# Altium schematic sheet STM32_BareBones.SchDoc: STM32_BareBones
size A4; DrawnBy: Seif Farag; DocumentNumber: P1; Revision: 1.1.1; SheetNumber: 1; SheetTotal: 1
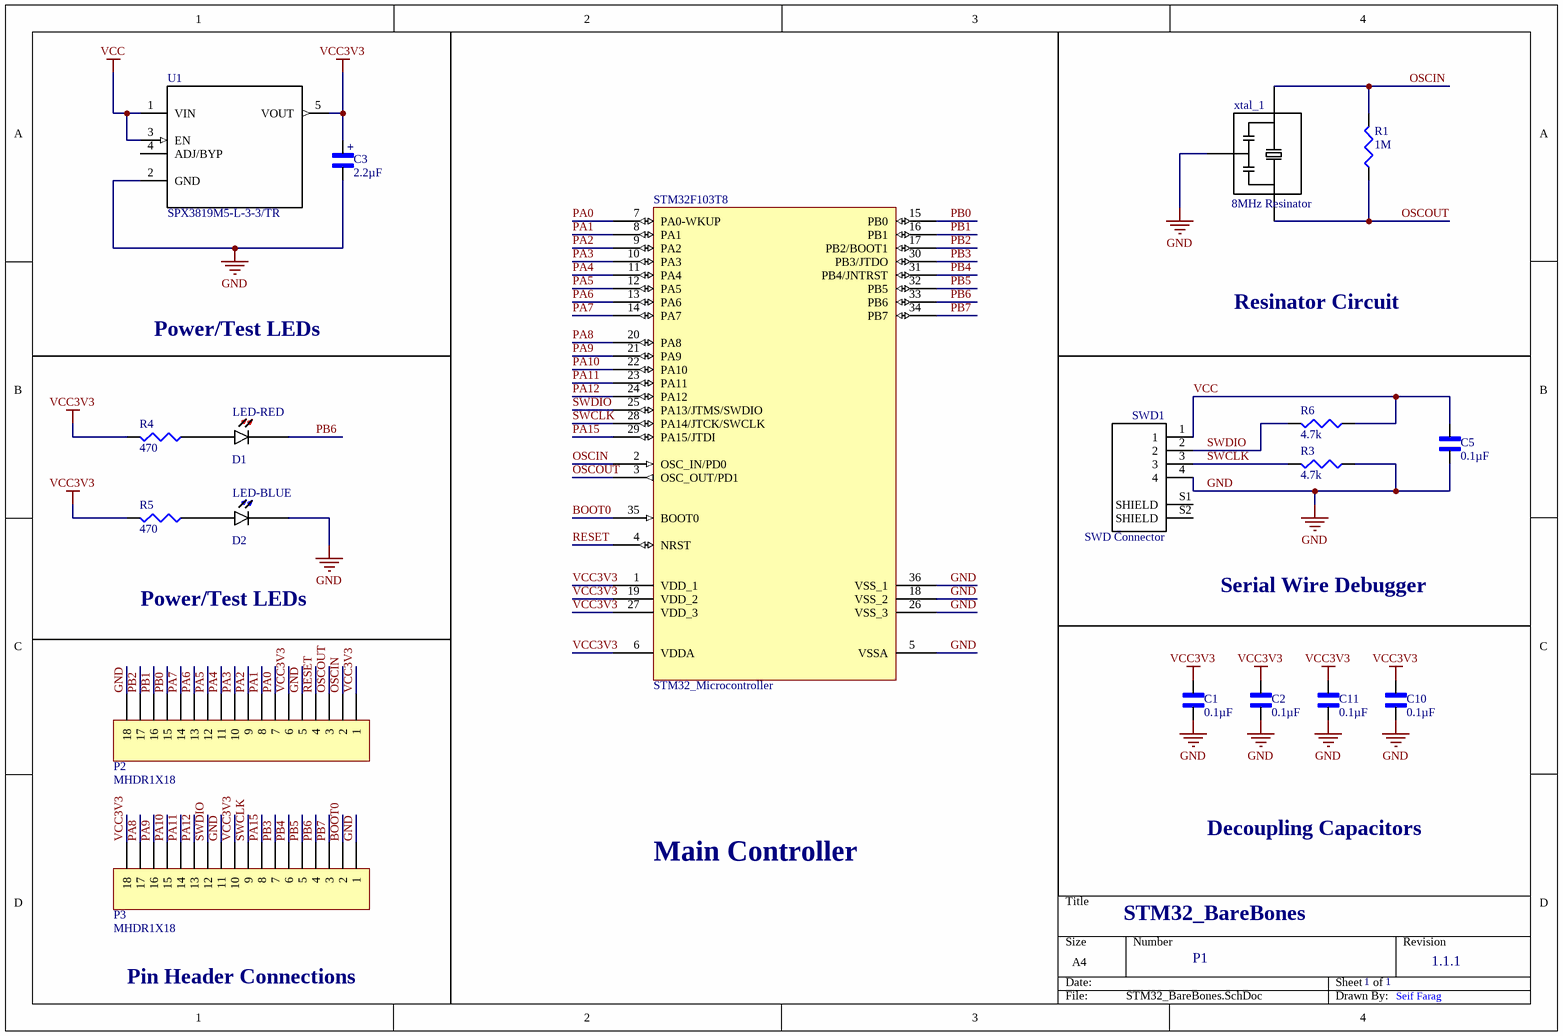
[diagram p0: STM32_BareBones.SchDoc]

## Parts
C1  value 0.1µF  [CAPC1608X90N]  (hidden comment: Cap)
C2  value 0.1µF  [CAPC1608X90N]  (hidden comment: Cap)
C3  value 2.2µF  [CAPC1608X90N]  (hidden comment: Cap)
C5  value 0.1µF  [CAPC1608X90N]  (hidden comment: Cap)
C10  value 0.1µF  [CAPC1608X90N]  (hidden comment: Cap)
C11  value 0.1µF  [CAPC1608X90N]  (hidden comment: Cap)
D1  LED-RED  [*LEDM1608X80_LTE-C1906R-14(Primary)]
D2  LED-BLUE  [*LEDM1608X80_LTE-C1906R-14(Primary)]
P2  MHDR1X18  [MHDR1X18]
P3  MHDR1X18  [MHDR1X18]
R1  value 1M  [J1-0603]  (hidden comment: RC0603FR-101KL)
R3  value 4.7k  [J1-0603]  (hidden comment: RC0603FR-101KL)
R4  value 470  [J1-0603]  (hidden comment: RC0603FR-101KL)
R5  value 470  [J1-0603]  (hidden comment: RC0603FR-101KL)
R6  value 4.7k  [J1-0603]  (hidden comment: RC0603FR-101KL)
STM32F103T8  STM32_Microcontroller  [*QFN50P600X600X100-37N]
SWD1  SWD Connector  [JST_BM04B-GHS-holes]
U1  SPX3819M5-L-3-3/TR  [*SOT95P280X145-5N]
xtal_1  8MHz Resinator  [*OSC_CSTCE8M00G55-R0]

## Nets
GND: C1.1 C2.1 C3.1 C5.1 C10.2 C11.1 D2.C P2.5 P2.18 P3.1 P3.11 R3.1 STM32F103T8.5(VSSA) STM32F103T8.18(VSS_2) STM32F103T8.26(VSS_3) STM32F103T8.36(VSS_1) SWD1.4 U1.2(GND) xtal_1.2
VCC: C5.2 R6.1 SWD1.1 U1.1(VIN) U1.3(EN)
VCC3V3: C1.2 C2.2 C3.2 C10.1 C11.2 P2.1 P2.6 P3.10 P3.18 R4.2 R5.2 STM32F103T8.1(VDD_1) STM32F103T8.6(VDDA) STM32F103T8.19(VDD_2) STM32F103T8.27(VDD_3) U1.5(VOUT)
BOOT0: P3.2 STM32F103T8.35(BOOT0)
OSCIN: P2.2 R1.2 STM32F103T8.2(OSC_IN/PD0) xtal_1.1
OSCOUT: P2.3 R1.1 STM32F103T8.3(OSC_OUT/PD1) xtal_1.3
PA0: P2.7 STM32F103T8.7(PA0-WKUP)
PA1: P2.8 STM32F103T8.8(PA1)
PA2: P2.9 STM32F103T8.9(PA2)
PA3: P2.10 STM32F103T8.10(PA3)
PA4: P2.11 STM32F103T8.11(PA4)
PA5: P2.12 STM32F103T8.12(PA5)
PA6: P2.13 STM32F103T8.13(PA6)
PA7: P2.14 STM32F103T8.14(PA7)
PA8: P3.17 STM32F103T8.20(PA8)
PA9: P3.16 STM32F103T8.21(PA9)
PA10: P3.15 STM32F103T8.22(PA10)
PA11: P3.14 STM32F103T8.23(PA11)
PA12: P3.13 STM32F103T8.24(PA12)
PA15: P3.8 STM32F103T8.29(PA15/JTDI)
PB0: P2.15 STM32F103T8.15(PB0)
PB1: P2.16 STM32F103T8.16(PB1)
PB2: P2.17 STM32F103T8.17(PB2/BOOT1)
PB3: P3.7 STM32F103T8.30(PB3/JTDO)
PB4: P3.6 STM32F103T8.31(PB4/JNTRST)
PB5: P3.5 STM32F103T8.32(PB5)
PB6: D1.C P3.4 STM32F103T8.33(PB6)
PB7: P3.3 STM32F103T8.34(PB7)
RESET: P2.4 STM32F103T8.4(NRST)
SWCLK: P3.9 R3.2 STM32F103T8.28(PA14/JTCK/SWCLK) SWD1.3
SWDIO: P3.12 R6.2 STM32F103T8.25(PA13/JTMS/SWDIO) SWD1.2
NetD1_A: D1.A R4.1
NetD2_A: D2.A R5.1

Not connected (* = marked no-connect by the designer): SWD1 S1(SHIELD) S2(SHIELD); U1 4(ADJ/BYP)

## Notes on the sheet
- (near C3) +
- Resinator Circuit
- Power/Test LEDs
- Serial Wire Debugger
- Decoupling Capacitors
- Main Controller
- Pin Header Connections

## Library data of the parts
C1-C3 C5 C10 C11 = C1608X7R1H474K080AC: 0.47µF ±10% 50V Ceramic Capacitor X7R 0603 _1608 Metric_; MF: TDK; Price: None; Package: 0603 (1608) TDK; SnapEDA_Link: https://www.snapeda.com/parts/C1608X7R1H474K080AC/TDK/view-part/360155/?ref=snap; Availability: Unavailable; MP: C1608X7R1H474K080AC; ChipDip_Link: https://www.chipdip.ru/product0/8576565346
D1 = 0603-LED-RED: Red 620nm LED Indication - Discrete 2.2V 0603 (1608 Metric); MP: LTST-C194KRKT or SML-D12U1WT86; Type: SMD; Package: 0603 Lite-On; SnapEDA_Link: https://www.snapeda.com/parts/LTE-C1906R-14/Lite-On%20Inc./view-part/?ref=snap; Value: *
D2 = 0603-LED-BLUE: LED IrLED Chip LED 2-Pin SMD T/R; MP: LTST-S270TBKT or  LTST-C194TBKT or LTST-C191TBKT or  SML-D12D1WT86; Package: 0603 Lite-On; SnapEDA_Link: https://www.snapeda.com/parts/LTE-C1906R-14/Lite-On%20Inc./view-part/?ref=snap; Value: *; Type: SMD
P2 P3 = MHDR1X18: Header, 18-Pin; LatestRevisionDate: 17-Jul-2002; LatestRevisionNote: Re-released for DXP Platform.; Publisher: Altium Limited
R1 R3-R6 = RC0603FR-101KL: 1 kOhms ±1% 0.1W, 1/10W Chip Resistor 0603 (1608 Metric) Moisture Resistant Thick Film; MF: Yageo or NXP; Pacage Metric: 1608; MP: RC0603FR-101KL; Package: R0603; SnapEDA_Link: https://www.snapeda.com/parts/RC0603FR-101KL/Yageo/view-part/?ref=search&t=RC0603FR-07%201k; Type: SMD
STM32F103T8 = STM32F103T8: STM32F103T8U6, Microcontroller 32BIT ARM 64K FLASH [VFQFPN-36]; MF: STM; ChipDip_Link: https://www.chipdip.ru/product/stm32f103t8u6-2; HelpURL: http://www.st.com/stonline/products/literature/ds/13587.pdf; MP: STM32F103T8U6; Package: VFQFPN-36; SnapEDA_Link: https://www.snapeda.com/parts/STM32F103T8U6TR/STMicroelectronics/view-part/?ref=search&t=STM32F103T8U6; Type: SMD
SWD1 = SWD SM04B-GHS-TB(LF)(SN)-: Conn Shrouded Header HDR 4 POS 1.25mm Solder ST SMD Reel; MF: JST Sales; Instructions: Do not install; SnapEDA_Link: https://www.snapeda.com/parts/BM04B-GHS-TBT%28LF%29%28SN%29%28N%29/JST%20Sales%20America%20Inc./view-part/?ref=snap; MP: SM04B-GHS-TB(LF)(SN); Package: None; Value: *; System: Connector; Type: SMD
U1 = SPX3819M5-L-3-3/TR: Low Dropout Voltage Regulator, Adjustable 0.5A, В±1%, 2.5 to 16 Vin, 5-Pin SOT-23; MF: MaxLinear, Inc.; Value: 3V3; MP: SPX3819M5-L-3-3/TR; Package: SOT-23-5 Exar; SnapEDA_Link: https://www.snapeda.com/parts/SPX3819M5-L/MaxLinear%2C%20Inc./view-part/?ref=snap; Type: SMD; ChipDip_Link: https://www.chipdip.ru/product1/8003455237; HelpURL: http://www.farnell.com/datasheets/2614478.pdf
xtal_1 = CSTCE8M00G55-R0: Ceramic Resonator 8MHz ??0.5% _Tol_ ??0.2% _Stability_ 33pF 40Ohm 3-Pin CSMD T/R; MF: Murata; MP: CSTCE8M00G55-R0; Package: SMD-3 Murata; SnapEDA_Link: https://www.snapeda.com/parts/CSTCE8M00G55-R0/Murata%20Electronics%20North%20America/view-part/?ref=snap; Value: *; ChipDip_Link: https://www.chipdip.ru/product1/8001783721; HelpURL: https://www.murata.com/en-eu/api/pdfdownloadapi?cate=&partno=CSTCE8M00G55-R0; Type: SMD